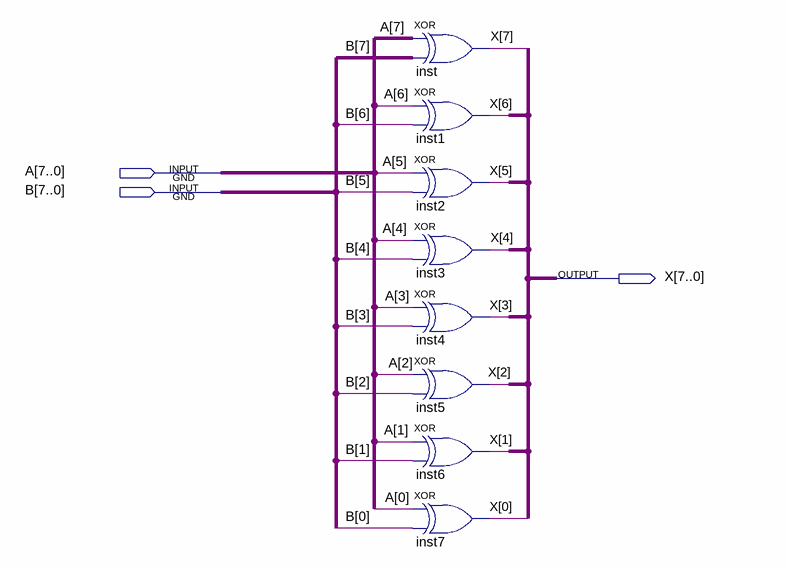
[diagram p0: schematic sheet]
// Quartus schematic xor8.bdf as structural Verilog: 8 symbols, 3 pins
module xor8 (
  input  [7:0] A,
  input  [7:0] B,
  output [7:0] X
);

  xor inst (X[7], A[7], B[7]);
  xor inst1 (X[6], A[6], B[6]);
  xor inst2 (X[5], A[5], B[5]);
  xor inst3 (X[4], A[4], B[4]);
  xor inst4 (X[3], A[3], B[3]);
  xor inst5 (X[2], A[2], B[2]);
  xor inst6 (X[1], A[1], B[1]);
  xor inst7 (X[0], A[0], B[0]);
endmodule
